# EAGLE schematic xmagaboard (EAGLE 5.03)

## Sheet 1 of 2
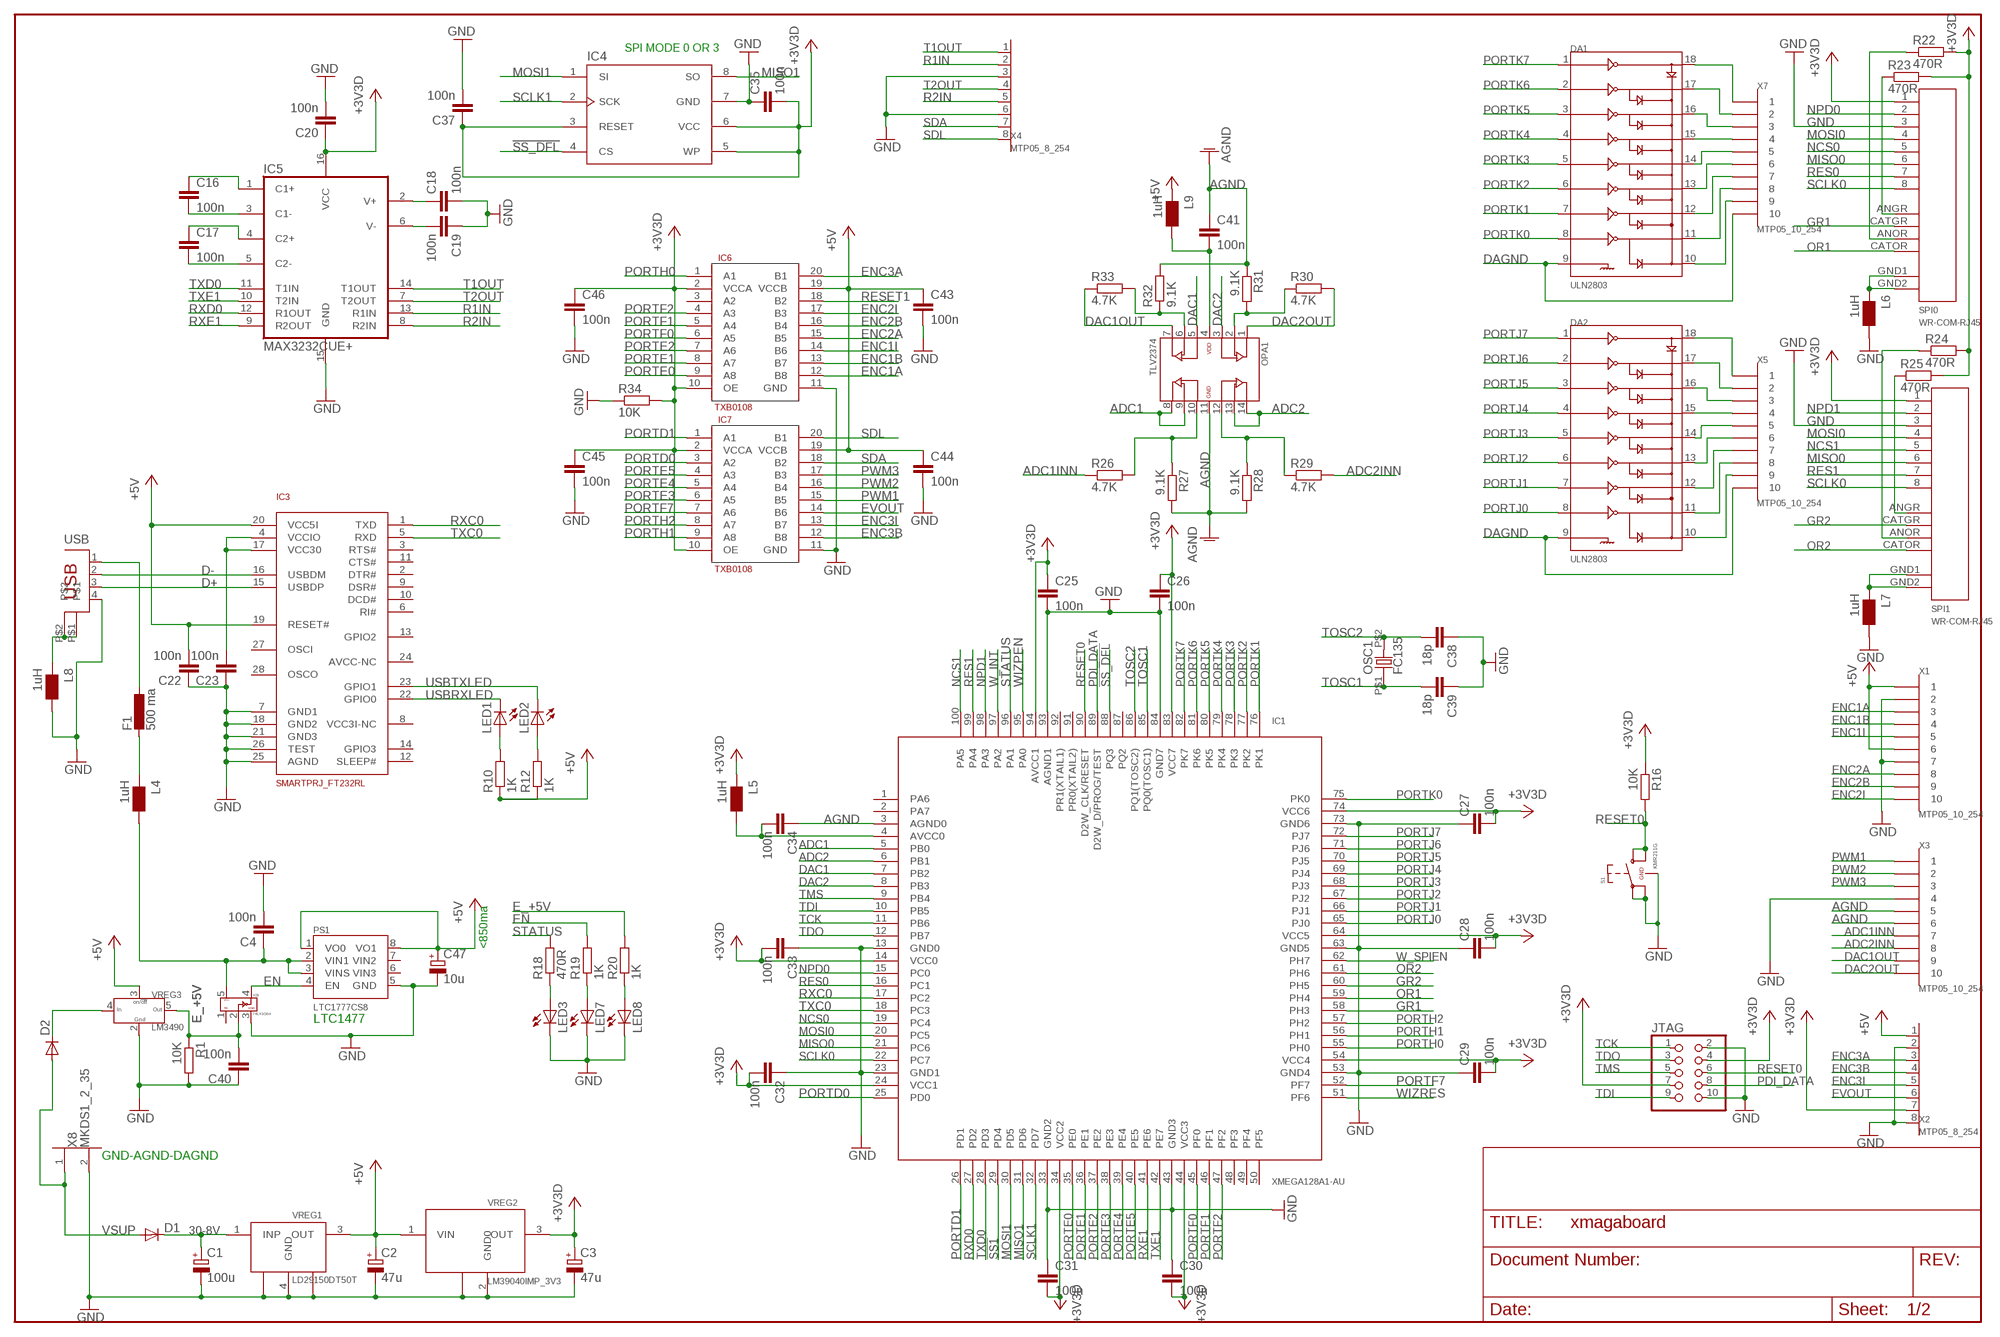
[diagram p0: schematic, sheet 1]

### Parts
C1  100u  CPOL-EUE  [PANASONIC_E]
C2  47u  CPOL-EUSMCC  [SMC_C]
C3  47u  CPOL-EUSMCC  [SMC_C]
C4  100n  C-EUC0603  [C0603]
C16  100n  C-EUC0603  [C0603]
C17  100n  C-EUC0603  [C0603]
C18  100n  C-EUC0603  [C0603]
C19  100n  C-EUC0603  [C0603]
C20  100n  C-EUC0603  [C0603]
C22  100n  C-EUC0603  [C0603]
C23  100n  C-EUC0603  [C0603]
C25  100n  C-EUC0603  [C0603]
C26  100n  C-EUC0603  [C0603]
C27  100n  C-EUC0603  [C0603]
C28  100n  C-EUC0603  [C0603]
C29  100n  C-EUC0603  [C0603]
C30  100n  C-EUC0603  [C0603]
C31  100n  C-EUC0603  [C0603]
C32  100n  C-EUC0603  [C0603]
C33  100n  C-EUC0603  [C0603]
C34  100n  C-EUC0603  [C0603]
C35  100n  C-EUC0603  [C0603]
C37  100n  C-EUC0603  [C0603]
C38  18p  C-EUC0603  [C0603]
C39  18p  C-EUC0603  [C0603]
C40  100n  C-EUC0603  [C0603]
C41  100n  C-EUC0603  [C0603]
C43  100n  C-EUC0603  [C0603]
C44  100n  C-EUC0603  [C0603]
C45  100n  C-EUC0603  [C0603]
C46  100n  C-EUC0603  [C0603]
C47  10u  CPOL-EUSMCA  [SMC_A]
D1  DIODE_DIODE-SMB  [DIODE_SMB]
D2  DIODE_DIODE-MICROMELF-R  [DIODE_MICROMELF-R]
DA1  ULN2803  [SO18]
DA2  ULN2803  [SO18]
F1  500 ma  RCL_L-EUL1812  [RCL_L1812]
IC1  XMEGA128A1-AU  [TQFP100]
IC3  SMARTPRJ_FT232RL  [SMARTPRJ_SSOP28]
IC4  ATMEL_DATA_FLASH  [SO08WIDE]
IC5  MAX3232CUE+  [TSSOP16]
IC6  TXB0108  [TSSOP20]
IC7  TXB0108  [TSSOP20]
IC8  74LX1G04  [SOT323-5]
JTAG  PINHD-2X5  [2X05]
L4  1uH  WUERTH-ELEKTRONIK_WE-CBF_0805  [WUERTH-ELEKTRONIK_0805]
L5  1uH  WUERTH-ELEKTRONIK_WE-CBF_0805  [WUERTH-ELEKTRONIK_0805]
L6  1uH  WUERTH-ELEKTRONIK_WE-CBF_0805  [WUERTH-ELEKTRONIK_0805]
L7  1uH  WUERTH-ELEKTRONIK_WE-CBF_0805  [WUERTH-ELEKTRONIK_0805]
L8  1uH  WUERTH-ELEKTRONIK_WE-CBF_0805  [WUERTH-ELEKTRONIK_0805]
L9  1uH  WUERTH-ELEKTRONIK_WE-CBF_0805  [WUERTH-ELEKTRONIK_0805]
LED1  LED_LEDCHIP-LED0805  [LED_CHIP-LED0805]
LED2  LED_LEDCHIP-LED0805  [LED_CHIP-LED0805]
LED3  LED_LEDCHIP-LED0805  [LED_CHIP-LED0805]
LED7  LED_LEDCHIP-LED0805  [LED_CHIP-LED0805]
LED8  LED_LEDCHIP-LED0805  [LED_CHIP-LED0805]
OPA1  TLV2374  [TSSOP14]
OSC1  FC135  [FC-135]
PS1  LTC1777CS8  [SO-08]
R1  10K  R-EU_R0603  [R0603]
R10  1K  R-EU_R0603  [R0603]
R12  1K  R-EU_R0603  [R0603]
R16  10K  R-EU_R0603  [R0603]
R18  470R  R-EU_R0603  [R0603]
R19  1K  R-EU_R0603  [R0603]
R20  1K  R-EU_R0603  [R0603]
R22  470R  R-EU_R0603  [R0603]
R23  470R  R-EU_R0603  [R0603]
R24  470R  R-EU_R0603  [R0603]
R25  470R  R-EU_R0603  [R0603]
R26  4.7K  R-EU_R0603  [R0603]
R27  9.1K  R-EU_R0603  [R0603]
R28  9.1K  R-EU_R0603  [R0603]
R29  4.7K  R-EU_R0603  [R0603]
R30  4.7K  R-EU_R0603  [R0603]
R31  9.1K  R-EU_R0603  [R0603]
R32  9.1K  R-EU_R0603  [R0603]
R33  4.7K  R-EU_R0603  [R0603]
R34  10K  R-EU_R0603  [R0603]
S1  KMR211G  [KMR211G]
SPI0  WR-COM-RJ45  [WR-CON_JR45]
SPI1  WR-COM-RJ45  [WR-CON_JR45]
USB  SMARTPRJ_PN61729  [SMARTPRJ_PN61729]
VREG1  LD29150DT50T  [DPACK]
VREG2  LM39040IMP_3V3  [SOT223]
VREG3  LM3490  [SOT23-5L]
X1  MTP05_10_254  [MTP05_10_254]
X2  MTP05_8_254  [MTP05_8_254]
X3  MTP05_10_254  [MTP05_10_254]
X4  MTP05_8_254  [MTP05_8_254]
X5  MTP05_10_254  [MTP05_10_254]
X7  MTP05_10_254  [MTP05_10_254]
X8  MKDS1_2_35  [MKDS1_2_35]

### Nets
30-8V: C1.+ D1.C VREG1.1(INP)
!SS1: IC1.29(PD4) ; also sheet 2
!SS_DFL: IC1.88(PQ3) IC4.4(CS)
+3V3A0: C34.2 IC1.4(AVCC0) L5.2
+3V3D: C3.+ C20.1 C25.1 C26.1 C27.2 C28.2 C29.2 C30.2 C31.2 C32.2 C33.2 C35.2 C37.1 C45.1 C46.1 IC1.14(VCC0) IC1.24(VCC1) IC1.34(VCC2) IC1.44(VCC3) IC1.54(VCC4) IC1.64(VCC5) IC1.74(VCC6) IC1.83(VCC7) IC1.94(AVCC1) IC4.3(RESET) IC4.5(WP) IC4.6(VCC) IC5.16(VCC) IC6.2(VCCA) IC6.10(OE) IC7.2(VCCA) IC7.10(OE) JTAG.4 JTAG.7 L5.1 R16.1 R22.2 R23.2 R24.2 R25.2 R34.2 SPI0.1 SPI1.1 VREG2.3(OUT) X2.7 ; also sheet 2
+5V: C2.+ C22.2 C43.1 C44.1 C47.+ IC3.19(RESET#) IC3.20(VCC5I) IC6.19(VCCB) IC7.19(VCCB) L9.1 PS1.1(VO0) PS1.8(VO1) R10.1 R12.1 VREG1.3(OUT) VREG2.1(VIN) VREG3.3 X1.1 X1.6 X2.1
ADC1: IC1.5(PB0) OPA1.8(3OUT) OPA1.9(3IN-)
ADC1INN: R26.1 X3.7
ADC2: IC1.6(PB1) OPA1.13(4IN-) OPA1.14(4OUT)
ADC2INN: R29.2 X3.8
AGND: C34.1 C41.1 IC1.3(AGND0) OPA1.11(GND) R27.2 R28.2 R31.1 R32.2 X3.5 X3.6
D+: IC3.15(USBDP) USB.3
D-: IC3.16(USBDM) USB.2
DAC1: IC1.7(PB2) OPA1.5(2IN+)
DAC1OUT: OPA1.7(2OUT) R33.1 X3.9
DAC2: IC1.8(PB3) OPA1.3(1IN+)
DAC2OUT: OPA1.1(1OUT) R30.2 X3.10
DAGND: DA1.9 DA2.9 X5.10 X7.10
E_+5V: C40.2 IC8.2 R1.1 R20.2 VREG3.5
EN: IC8.4 PS1.4(EN) R19.2
ENC1A: IC6.12(B8) X1.3
ENC1B: IC6.13(B7) X1.4
ENC1I: IC6.14(B6) X1.5
ENC2A: IC6.15(B5) X1.8
ENC2B: IC6.16(B4) X1.9
ENC2I: IC6.17(B3) X1.10
ENC3A: IC6.20(B1) X2.3
ENC3B: IC7.12(B8) X2.4
ENC3I: IC7.13(B7) X2.5
EVOUT: IC7.14(B6) X2.6
GND: C1.- C2.- C3.- C4.2 C18.2 C19.1 C20.2 C22.1 C23.1 C25.2 C26.2 C27.1 C28.1 C29.1 C30.1 C31.1 C32.1 C33.1 C35.1 C37.2 C38.1 C39.1 C40.1 C43.2 C44.2 C45.2 C46.2 C47.- IC1.13(GND0) IC1.23(GND1) IC1.33(GND2) IC1.43(GND3) IC1.53(GND4) IC1.63(GND5) IC1.73(GND6) IC1.84(GND7) IC1.93(AGND1) IC3.7(GND1) IC3.18(GND2) IC3.21(GND3) IC3.25(AGND) IC3.26(TEST) IC4.7(GND) IC5.15(GND) IC6.11(GND) IC7.11(GND) IC8.3 JTAG.2 JTAG.10 L6.2 L7.2 L8.2 LED3.C LED7.C LED8.C PS1.5(GND) R1.2 R34.1 S1.1 S1.3 S1.5 SPI0.3 SPI1.3 USB.4 VREG1.4(GND) VREG1.TPAD1 VREG1.TPAD2 VREG2.2(GND0) VREG2.GND VREG3.2 X1.2 X1.7 X2.2 X2.8 X3.4 X4.3 X4.6 X8.2 ; also sheet 2
GR1: IC1.58(PH3) SPI0.CATGR
GR2: IC1.60(PH5) SPI1.CATGR
MISO0: IC1.21(PC6) SPI0.6 SPI1.6
MISO1: IC1.31(PD6) IC4.8(SO) ; also sheet 2
MOSI0: IC1.20(PC5) SPI0.4 SPI1.4
MOSI1: IC1.30(PD5) IC4.1(SI) ; also sheet 2
N$2: C41.2 L9.2 OPA1.4(VDD)
N$11: DA2.10 X5.9
N$19: LED1.A R10.2
N$20: C16.1 IC5.1(C1+)
N$21: C16.2 IC5.3(C1-)
N$22: C17.1 IC5.4(C2+)
N$23: C17.2 IC5.5(C2-)
N$24: C19.2 IC5.6(V-)
N$25: C18.1 IC5.2(V+)
N$28: OPA1.10(3IN+) R26.2 R27.1
N$29: OPA1.12(4IN+) R28.1 R29.1
N$30: LED2.A R12.2
N$31: F1.1 USB.1
N$38: OPA1.6(2IN-) R32.1 R33.2
N$40: OPA1.2(1IN-) R30.1 R31.2
N$46: C23.2 IC3.4(VCCIO) IC3.17(VCC30)
N$47: L8.1 USB.P$1 USB.P$2
N$49: D2.C VREG3.4
N$50: F1.2 L4.1
N$58: LED3.A R18.1
N$59: LED7.A R19.1
N$60: LED8.A R20.1
N$162: DA2.11 X5.8
N$163: DA2.12 X5.7
N$164: DA2.13 X5.6
N$165: DA2.14 X5.5
N$166: DA2.15 X5.4
N$167: DA2.16 X5.3
N$168: DA2.17 X5.2
N$169: DA2.18 X5.1
N$170: DA1.18 X7.1
N$171: DA1.17 X7.2
N$172: DA1.16 X7.3
N$173: DA1.15 X7.4
N$174: DA1.14 X7.5
N$175: DA1.13 X7.6
N$176: DA1.12 X7.7
N$177: DA1.11 X7.8
N$178: DA1.10 X7.9
N$179: L6.1 SPI0.GND1 SPI0.GND2
N$180: L7.1 SPI1.GND1 SPI1.GND2
N$184: R23.1 SPI0.ANGR
N$185: R22.1 SPI0.ANOR
N$186: R25.1 SPI1.ANGR
N$187: R24.1 SPI1.ANOR
NCS0: IC1.19(PC4) SPI0.5
NCS1: IC1.100(PA5) SPI1.5
NPD0: IC1.15(PC0) SPI0.2
NPD1: IC1.98(PA3) SPI1.2
OR1: IC1.59(PH4) SPI0.CATOR
OR2: IC1.61(PH6) SPI1.CATOR
PDI_DATA: IC1.89(D2W_D/PROG/TEST) JTAG.8
PORTD0: IC1.25(PD0) IC7.3(A2)
PORTD1: IC1.26(PD1) IC7.1(A1)
PORTE0: IC1.35(PE0) IC6.9(A8)
PORTE1: IC1.36(PE1) IC6.8(A7)
PORTE2: IC1.37(PE2) IC6.7(A6)
PORTE3: IC1.38(PE3) IC7.6(A5)
PORTE4: IC1.39(PE4) IC7.5(A4)
PORTE5: IC1.40(PE5) IC7.4(A3)
PORTF0: IC1.45(PF0) IC6.6(A5)
PORTF1: IC1.46(PF1) IC6.5(A4)
PORTF2: IC1.47(PF2) IC6.4(A3)
PORTF7: IC1.52(PF7) IC7.7(A6)
PORTH0: IC1.55(PH0) IC6.1(A1)
PORTH1: IC1.56(PH1) IC7.9(A8)
PORTH2: IC1.57(PH2) IC7.8(A7)
PORTJ0: DA2.8 IC1.65(PJ0)
PORTJ1: DA2.7 IC1.66(PJ1)
PORTJ2: DA2.6 IC1.67(PJ2)
PORTJ3: DA2.5 IC1.68(PJ3)
PORTJ4: DA2.4 IC1.69(PJ4)
PORTJ5: DA2.3 IC1.70(PJ5)
PORTJ6: DA2.2 IC1.71(PJ6)
PORTJ7: DA2.1 IC1.72(PJ7)
PORTK0: DA1.8 IC1.75(PK0)
PORTK1: DA1.7 IC1.76(PK1)
PORTK2: DA1.6 IC1.77(PK2)
PORTK3: DA1.5 IC1.78(PK3)
PORTK4: DA1.4 IC1.79(PK4)
PORTK5: DA1.3 IC1.80(PK5)
PORTK6: DA1.2 IC1.81(PK6)
PORTK7: DA1.1 IC1.82(PK7)
PWM1: IC7.15(B5) X3.1
PWM2: IC7.16(B4) X3.2
PWM3: IC7.17(B3) X3.3
R1IN: IC5.13(R1IN) X4.2
R2IN: IC5.8(R2IN) X4.5
RES0: IC1.16(PC1) SPI0.7
RES1: IC1.99(PA4) SPI1.7
RESET0: IC1.90(D2W_CLK/RESET) JTAG.6 R16.2 S1.2 S1.4
RESET1: IC6.18(B2)
RXC0: IC1.17(PC2) IC3.1(TXD)
RXD0: IC1.27(PD2) IC5.12(R1OUT)
RXE1: IC1.41(PE6) IC5.9(R2OUT)
SCLK0: IC1.22(PC7) SPI0.8 SPI1.8
SCLK1: IC1.32(PD7) IC4.2(SCK) ; also sheet 2
SDA: IC7.18(B2) X4.7
SDL: IC7.20(B1) X4.8
STATUS: IC1.96(PA1) R18.2
T1OUT: IC5.14(T1OUT) X4.1
T2OUT: IC5.7(T2OUT) X4.4
TCK: IC1.11(PB6) JTAG.1
TDI: IC1.10(PB5) JTAG.9
TDO: IC1.12(PB7) JTAG.3
TMS: IC1.9(PB4) JTAG.5
TOSC1: C39.2 IC1.85(PQ0(TOSC1)) OSC1.P$1
TOSC2: C38.2 IC1.86(PQ1(TOSC2)) OSC1.P$2
TXC0: IC1.18(PC3) IC3.5(RXD)
TXD0: IC1.28(PD3) IC5.11(T1IN)
TXE1: IC1.42(PE7) IC5.10(T2IN)
USBPOW: C4.1 IC8.5 L4.2 PS1.2(VIN1) PS1.3(VINS)
USBRXLED: IC3.22(GPIO0) LED1.C
USBTXLED: IC3.23(GPIO1) LED2.C
VSUP: D1.A D2.A X8.1
W_INT: IC1.97(PA2) ; also sheet 2
W_SPIEN: IC1.62(PH7) ; also sheet 2
WIZPEN: IC1.95(PA0) ; also sheet 2
WIZRES: IC1.51(PF6) ; also sheet 2
Unconnected: IC1.1(PA6) IC1.2(PA7) IC1.48(PF3) IC1.49(PF4) IC1.50(PF5) IC1.87(PQ2) IC1.91(PR0(XTAIL2)) IC1.92(PR1(XTAIL1)) IC3.2(DTR#) IC3.3(RTS#) IC3.6(RI#) IC3.8(VCC3I-NC) IC3.9(DSR#) IC3.10(DCD#) IC3.11(CTS#) IC3.12(SLEEP#) IC3.13(GPIO2) IC3.14(GPIO3) IC3.24(AVCC-NC) IC3.27(OSCI) IC3.28(OSCO) IC6.3(A2) IC8.1 PS1.6(VIN3) PS1.7(VIN2)

### Notes on the sheet
- SPI MODE 0 OR 3
- <850ma
- LTC1477
- GND-AGND-DAGND

## Sheet 2 of 2
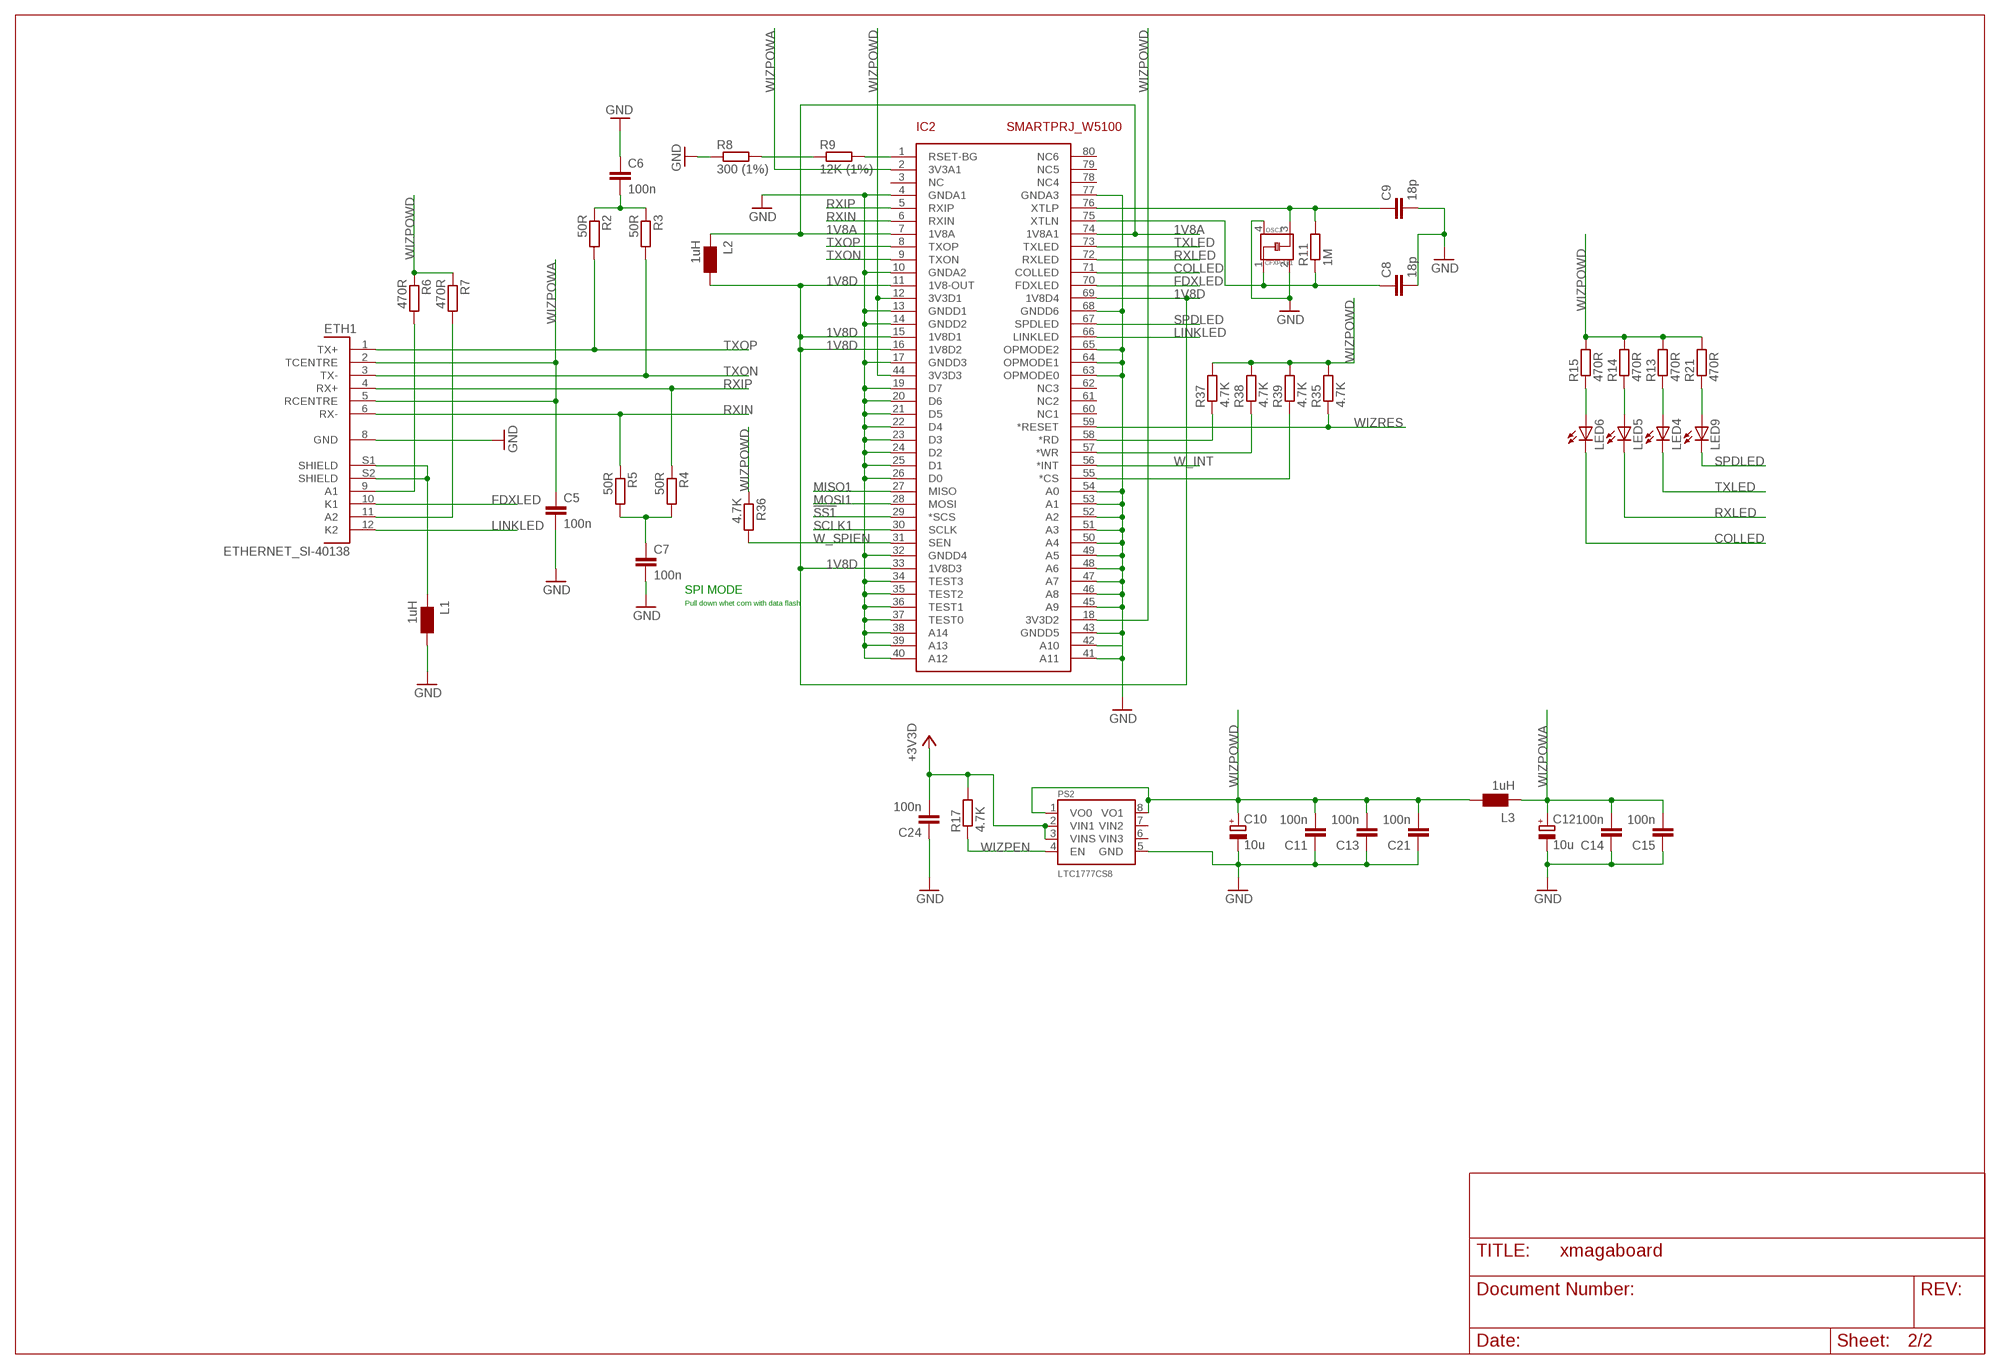
[diagram p1: schematic, sheet 2]

### Parts
C5  100n  C-EUC0603  [C0603]
C6  100n  C-EUC0603  [C0603]
C7  100n  C-EUC0603  [C0603]
C8  18p  C-EUC0603  [C0603]
C9  18p  C-EUC0603  [C0603]
C10  10u  RCL_CPOL-EUSMCA  [RCL_SMC_A]
C11  100n  C-EUC0603  [C0603]
C12  10u  RCL_CPOL-EUSMCA  [RCL_SMC_A]
C13  100n  C-EUC0603  [C0603]
C14  100n  C-EUC0603  [C0603]
C15  100n  C-EUC0603  [C0603]
C21  100n  C-EUC0603  [C0603]
C24  100n  C-EUC0603  [C0603]
ETH1  ETHERNET_SI-40138  [ETHERNET_SI40138]
IC2  SMARTPRJ_W5100  [SMARTPRJ_SQFP-S-10X10-80]
L1  1uH  WUERTH-ELEKTRONIK_WE-CBF_0805  [WUERTH-ELEKTRONIK_0805]
L2  1uH  WUERTH-ELEKTRONIK_WE-CBF_0805  [WUERTH-ELEKTRONIK_0805]
L3  1uH  WUERTH-ELEKTRONIK_WE-CBF_0805  [WUERTH-ELEKTRONIK_0805]
LED4  LED_LEDCHIP-LED0805  [LED_CHIP-LED0805]
LED5  LED_LEDCHIP-LED0805  [LED_CHIP-LED0805]
LED6  LED_LEDCHIP-LED0805  [LED_CHIP-LED0805]
LED9  LED_LEDCHIP-LED0805  [LED_CHIP-LED0805]
OSC2  CFXP-181  [CFPX-181]
PS2  LTC1777CS8  [SO-08]
R2  50R  R-EU_R0603  [R0603]
R3  50R  R-EU_R0603  [R0603]
R4  50R  R-EU_R0603  [R0603]
R5  50R  R-EU_R0603  [R0603]
R6  470R  R-EU_R0603  [R0603]
R7  470R  R-EU_R0603  [R0603]
R8  300 (1%)  R-EU_R0603  [R0603]
R9  12K (1%)  R-EU_R0603  [R0603]
R11  1M  R-EU_R0603  [R0603]
R13  470R  R-EU_R0603  [R0603]
R14  470R  R-EU_R0603  [R0603]
R15  470R  R-EU_R0603  [R0603]
R17  4.7K  R-EU_R0603  [R0603]
R21  470R  R-EU_R0603  [R0603]
R35  4.7K  R-EU_R0603  [R0603]
R36  4.7K  R-EU_R0603  [R0603]
R37  4.7K  R-EU_R0603  [R0603]
R38  4.7K  R-EU_R0603  [R0603]
R39  4.7K  R-EU_R0603  [R0603]

### Nets
1V8A: IC2.7(1V8A) IC2.74(1V8A1) L2.1
1V8D: IC2.11(1V8-OUT) IC2.15(1V8D1) IC2.16(1V8D2) IC2.33(1V8D3) IC2.69(1V8D4) L2.2
!SS1: IC2.29(*SCS) ; also sheet 1
+3V3D: C24.2 PS2.2(VIN1) PS2.3(VINS) R17.2 ; also sheet 1
COLLED: IC2.71(COLLED) LED6.C
FDXLED: ETH1.10(K1) IC2.70(FDXLED)
GND: C5.2 C6.1 C7.2 C8.2 C9.2 C10.- C11.1 C12.- C13.1 C14.1 C15.1 C21.1 C24.1 ETH1.8(GND) IC2.4(GNDA1) IC2.10(GNDA2) IC2.13(GNDD1) IC2.14(GNDD2) IC2.17(GNDD3) IC2.19(D7) IC2.20(D6) IC2.21(D5) IC2.22(D4) IC2.23(D3) IC2.24(D2) IC2.25(D1) IC2.26(D0) IC2.32(GNDD4) IC2.34(TEST3) IC2.35(TEST2) IC2.36(TEST1) IC2.37(TEST0) IC2.38(A14) IC2.39(A13) IC2.40(A12) IC2.41(A11) IC2.42(A10) IC2.43(GNDD5) IC2.45(A9) IC2.46(A8) IC2.47(A7) IC2.48(A6) IC2.49(A5) IC2.50(A4) IC2.51(A3) IC2.52(A2) IC2.53(A1) IC2.54(A0) IC2.63(OPMODE0) IC2.64(OPMODE1) IC2.65(OPMODE2) IC2.68(GNDD6) IC2.77(GNDA3) L1.2 OSC2.2 OSC2.4 PS2.5(GND) R8.1 ; also sheet 1
LINKLED: ETH1.12(K2) IC2.66(LINKLED)
MISO1: IC2.27(MISO) ; also sheet 1
MOSI1: IC2.28(MOSI) ; also sheet 1
N$5: ETH1.9(A1) R6.2
N$6: ETH1.11(A2) R7.2
N$8: LED9.A R21.1
N$9: C9.1 IC2.76(XTLP) OSC2.3 R11.2
N$10: C6.2 R2.1 R3.1
N$12: C8.1 IC2.75(XTLN) OSC2.1 R11.1
N$14: C7.1 R4.2 R5.2
N$15: ETH1.S1(SHIELD) ETH1.S2(SHIELD) L1.1
N$17: R8.2 R9.1
N$18: IC2.1(RSET-BG) R9.2
N$32: LED6.A R15.1
N$33: LED5.A R14.1
N$34: LED4.A R13.1
N$52: IC2.55(*CS) R39.1
N$53: IC2.57(*WR) R38.1
N$54: IC2.58(*RD) R37.1
RXIN: ETH1.6(RX-) IC2.6(RXIN) R5.1
RXIP: ETH1.4(RX+) IC2.5(RXIP) R4.1
RXLED: IC2.72(RXLED) LED5.C
SCLK1: IC2.30(SCLK) ; also sheet 1
SPDLED: IC2.67(SPDLED) LED9.C
TXLED: IC2.73(TXLED) LED4.C
TXON: ETH1.3(TX-) IC2.9(TXON) R3.2
TXOP: ETH1.1(TX+) IC2.8(TXOP) R2.2
W_INT: IC2.56(*INT) ; also sheet 1
W_SPIEN: IC2.31(SEN) R36.2 ; also sheet 1
WIZPEN: PS2.4(EN) R17.1 ; also sheet 1
WIZPOWA: C5.1 C12.+ C14.2 C15.2 ETH1.2(TCENTRE) ETH1.5(RCENTRE) IC2.2(3V3A1) L3.1
WIZPOWD: C10.+ C11.2 C13.2 C21.2 IC2.12(3V3D1) IC2.18(3V3D2) IC2.44(3V3D3) L3.2 PS2.1(VO0) PS2.8(VO1) R6.1 R7.1 R13.2 R14.2 R15.2 R21.2 R35.2 R36.1 R37.2 R38.2 R39.2
WIZRES: IC2.59(*RESET) R35.1 ; also sheet 1
Unconnected: IC2.3(NC) IC2.60(NC1) IC2.61(NC2) IC2.62(NC3) IC2.78(NC4) IC2.79(NC5) IC2.80(NC6) PS2.6(VIN3) PS2.7(VIN2)

### Notes on the sheet
- SPI MODE
- Pull down whet com with data flash

## Library data of the parts
C1-C3 C47 = rcl:CPOL-EU: POLARIZED CAPACITOR, European symbol
C4-C9 C11 C13-C35 C37-C41 C43-C46 = rcl:C-EU: CAPACITOR, European symbol
C10 C12 = arduino-ethernet-shield:RCL_CPOL-EU: POLARIZED CAPACITOR, European symbol
D1 D2 = arduino_2009:DIODE_DIODE-: DIODE
DA1 DA2 = mylibary:ULN2803
ETH1 = arduino-ethernet-shield:ETHERNET_SI-40138: Ethernet Jack with Integrated Magnetics The Belfuse SI-10021 (Rapid order code 24-0484) is a single RJ-45 jack with integrated magnetics, suitable for Ethernet use.
F1 = arduino_2009:RCL_L-EU: INDUCTOR, European symbol
IC1 = atmel:XMEGA128A1-AU
IC2 = arduino-ethernet-shield:SMARTPRJ_W5100
IC3 = arduino_2009:SMARTPRJ_FT232RL
IC4 = SparkFun:ATMEL_DATA_FLASH: 16Mbit EEPROM DataFlash Footprint needs touching up. Spark Fun Electronics SKU : COM-00301
IC5 = SparkFun:MAX3232CUE+
IC6 IC7 = mylibary:TXB0108
IC8 = mylibary:74LX1G04
JTAG = pinhead:PINHD-2X5: PIN HEADER
L1-L9 = arduino-ethernet-shield:WUERTH-ELEKTRONIK_WE-CBF: SMD EMI Suppression Ferrite Beads - excellent anti-EMI properties - low DCR - impedances till 3000 ohms - rated current up to 6 A
LED1-LED9 = arduino_2009:LED_LED: LED OSRAM: - CHIPLED LG R971, LG N971, LY N971, LG Q971, LY Q971, LO R971, LY R971 LH N974, LH R974 LS Q976, LO Q976, LY Q976 LO Q996 - Hyper CHIPLED LW Q18S LB Q993, LB Q99A, LB R99A - SideLED LS A670, LO A670, LY A670, LG A670, LP A670 LB A673, LV A673, LT A673, LW A673 LH A674 LY A675 LS A676, LA A676, LO A676, LY A676, LW A676 LS A679, LY A679, LG A679 - Hyper Micro SIDELED® LS Y876, LA Y876, LO Y876, LY Y876 LT Y87S - SmartLED LW L88C, LW L88S LB L89C, LB L89S, LG L890 LS L89K, LO L89K, LY L89K LS L896, LA L896, LO L896, LY L896 - TOPLED LS T670, LO T670, LY T670, LG T670, LP T670 LSG T670, LSP T670, LSY T670, LOP T670, LYG T670 LG T671, LOG T671, LSG T671 LB T673, LV T673, LT T673, LW T673 LH T674 LS T676, LA T676, LO T676, LY T676, LB T676, LH T676, LSB T676, LW T676 LB T67C, LV T67C, LT T67C, LS T67K, LO T67K, LY T67K, LW E67C LS E67B, LA E67B, LO E67B, LY E67B, LB E67C, LV E67C, LT E67C LW T67C LS T679, LY T679, LG T679 LS T770, LO T770, LY T770, LG T770, LP T770 LB T773, LV T773, LT T773, LW T773 LH T774 LS E675, LA E675, LY E675, LS T675 LS T776, LA T776, LO T776, LY T776, LB T776 LHGB T686 LT T68C, LB T68C - Hyper Mini TOPLED® LB M676 - Mini TOPLED Santana® LG M470 LS M47K, LO M47K, LY M47K Source: http://www.osram.convergy.de/
OPA1 = mylibary:TLV2374
OSC1 = mylibary:FC135
OSC2 = mylibary:CFXP-181
PS1 PS2 = mylibary:LTC1777CS8
R1-R39 = rcl:R-EU_: RESISTOR, European symbol
S1 = mylibary:KMR211G
SPI0 SPI1 = mylibary:WR-COM-RJ45
USB = arduino_2009:SMARTPRJ_PN61729: BERG USB connector
VREG1 = mylibary:LD29150DT50T
VREG2 = mylibary:LM39040IMP_3V3
VREG3 = mylibary:LM3490
X1 X3 X5 X7 = mylibary:MTP05_10_254
X2 X4 = mylibary:MTP05_8_254
X8 = mylibary:MKDS1_2_35

## Net classes
1 signal: width 0.254 mm